# EAGLE design Handheld (EAGLE 8.0.0)
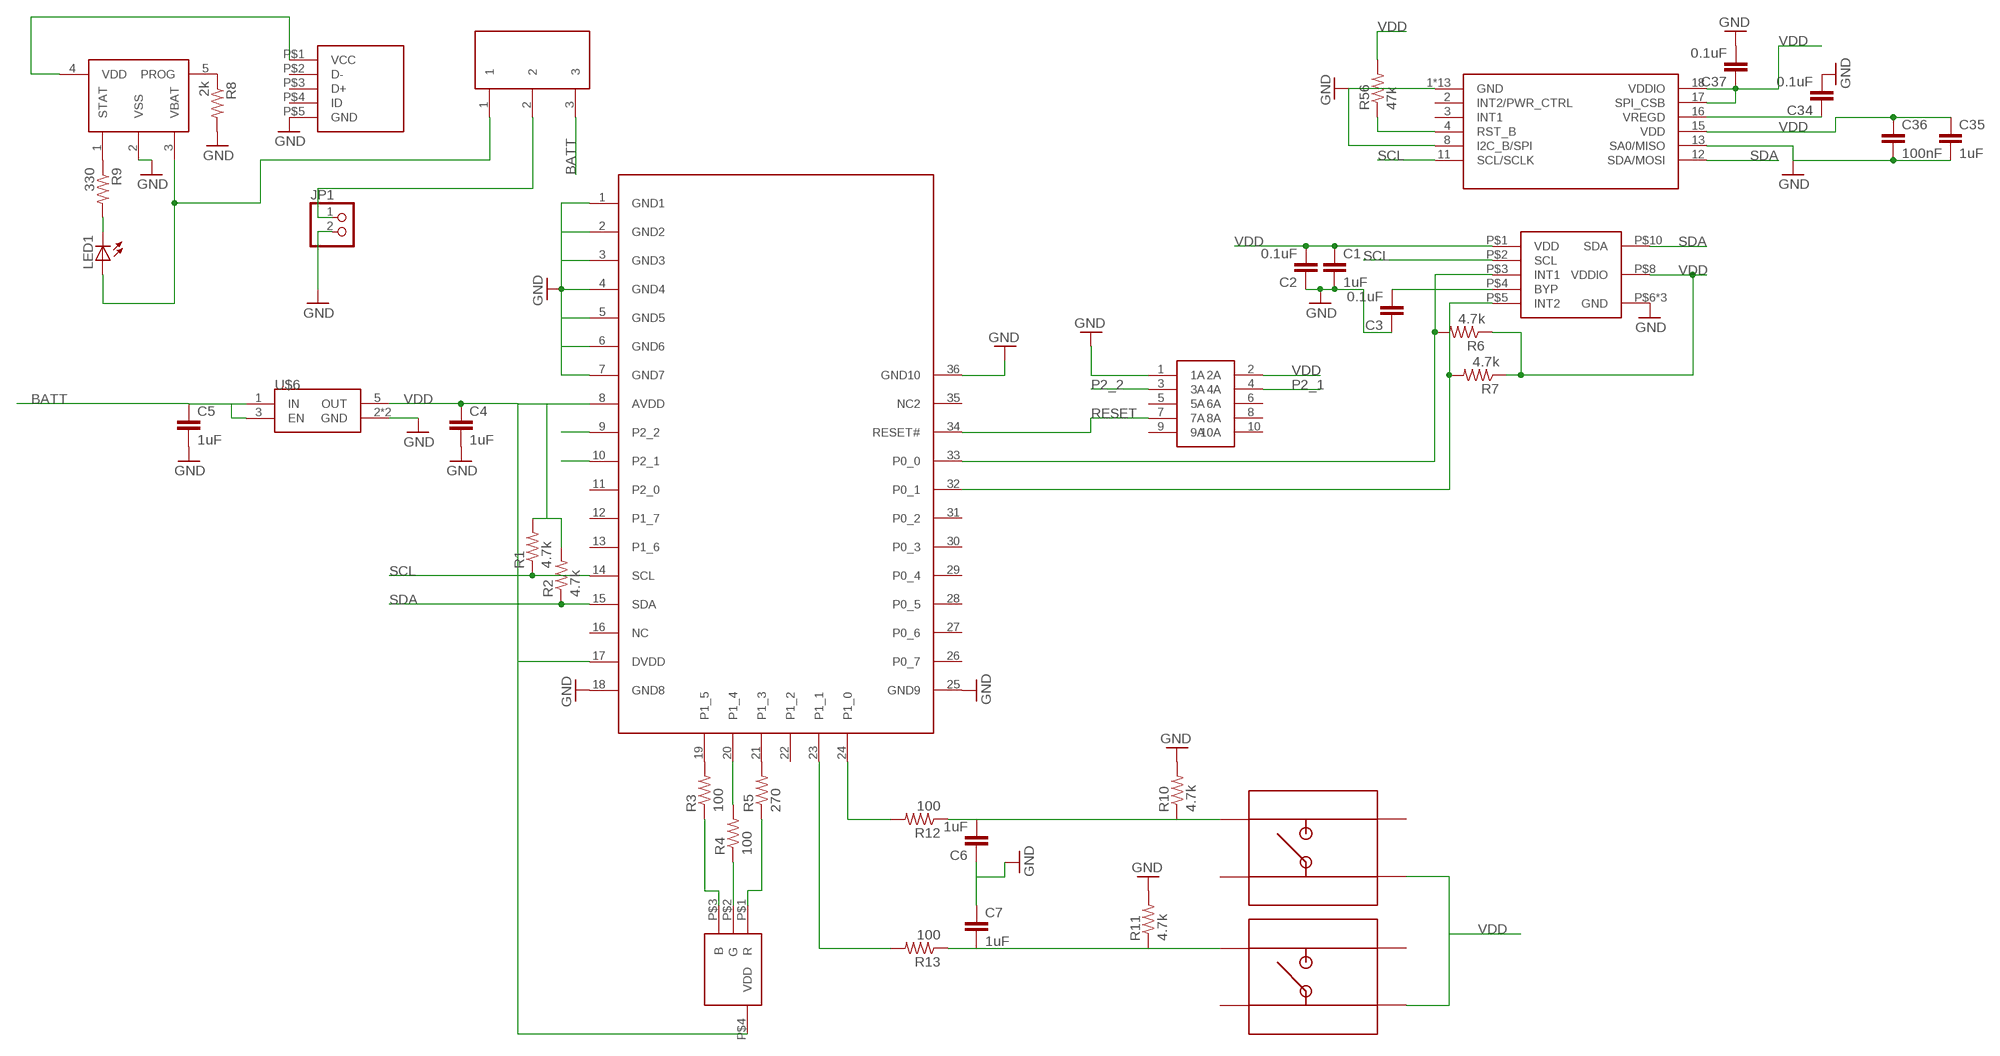
[diagram p0: schematic, sheet 1]

## Parts
C1  1uF  C-EUC0402  [C0402]
C2  0.1uF  C-EUC0402  [C0402]
C3  0.1uF  C-EUC0402  [C0402]
C4  1uF  C-EUC0402  [C0402]
C5  1uF  C-EUC0402  [C0402]
C6  1uF  C-EUC0402  [C0402]
C7  1uF  C-EUC0402  [C0402]
C34  0.1uF  C-EUC0402  [C0402]
C35  1uF  C-EUC0402  [C0402]
C36  100nF  C-EUC0402  [C0402]
C37  0.1uF  C-EUC0402  [C0402]
JP1  PINHD-1X2  [1X02]
LED1  LEDCHIPLED_0805  [CHIPLED_0805]
R1  4.7k  R-US_R0402  [R0402]
R2  4.7k  R-US_R0402  [R0402]
R3  100  R-US_R0402  [R0402]
R4  100  R-US_R0402  [R0402]
R5  270  R-US_R0402  [R0402]
R6  4.7k  R-US_R0402  [R0402]
R7  4.7k  R-US_R0402  [R0402]
R8  2k  R-US_R0402  [R0402]
R9  330  R-US_R0402  [R0402]
R10  4.7k  R-US_R0402  [R0402]
R11  4.7k  R-US_R0402  [R0402]
R12  100  R-US_R0402  [R0402]
R13  100  R-US_R0402  [R0402]
R56  47k  R-US_R0402  [R0402]
U$1  BLE113  [BLUEGIGA]
U$2  RIBBON_10POS_MALE  [RIBBON_10POS_MALE]
U$3  MMA8653FC  [10-DFN2X2]
U$4  MCP73831  [MCP73831]
U$5  MICRO_USB  [MOLEX_USB]
U$6  TPS782XX  [SOT23-5L]
U$7  LTST-C19HE1WT  [LTST-C19HE1WT]
U$8  SMD_TACTILE  [EVQ-Q2U03W]
U$9  SMD_TACTILE  [EVQ-Q2U03W]
U$10  SPDT_THRU  [SPDT_THRU]
U$34  FXAS21002  [FXAS21002]

## Nets
BATT: C5.1 U$6.1(IN) U$6.3(EN) U$10.3
GND: C1.2 C2.1 C3.1 C4.2 C5.2 C6.1 C7.1 C34.2 C35.2 C36.2 C37.2 JP1.2 R8.2 R10.2 R11.2 U$1.1(GND1) U$1.2(GND2) U$1.3(GND3) U$1.4(GND4) U$1.5(GND5) U$1.6(GND6) U$1.7(GND7) U$1.18(GND8) U$1.25(GND9) U$1.36(GND10) U$2.1(1A) U$3.P$6(GND) U$3.P$7(GND) U$3.P$9(GND) U$4.2(VSS) U$5.P$5(GND) U$6.2(GND) U$6.4(GND) U$34.1(GND) U$34.5(GND) U$34.6(GND) U$34.7(GND) U$34.8(I2C_B/SPI) U$34.9(GND) U$34.10(GND) U$34.13(SA0/MISO) U$34.14(GND) U$34.19(GND) U$34.20(GND) U$34.21(GND) U$34.22(GND) U$34.23(GND) U$34.24(GND)
N$1: C7.2 R11.1 R13.1 U$9.1
N$2: R3.2 U$1.19(P1_5)
N$3: C3.2 U$3.P$4(BYP)
N$4: R4.2 U$1.20(P1_4)
N$5: R5.2 U$1.21(P1_3)
N$6: R3.1 U$7.P$3(B)
N$7: R4.1 U$7.P$2(G)
N$8: R5.1 U$7.P$1(R)
N$9: R6.2 U$1.33(P0_0) U$3.P$3(INT1)
N$10: R7.2 U$1.32(P0_1) U$3.P$5(INT2)
N$11: R8.1 U$4.5(PROG)
N$12: R9.1 U$4.1(STAT)
N$13: LED1.C R9.2
N$14: LED1.A U$4.3(VBAT) U$10.1
N$15: U$4.4(VDD) U$5.P$1(VCC)
N$16: JP1.1 U$10.2
N$17: R13.2 U$1.23(P1_1)
N$18: U$1.9(P2_2)
N$19: U$1.10(P2_1)
N$20: R12.2 U$1.24(P1_0)
N$22: C6.2 R10.1 R12.1 U$8.1
N$30: R56.1 U$34.4(RST_B)
N$78: C34.1 U$34.16(VREGD)
P2_1: U$2.4(4A)
P2_2: U$2.3(3A)
RESET: U$1.34(RESET#) U$2.7(7A)
SCL: R1.1 U$1.14(SCL) U$3.P$2(SCL) U$34.11(SCL/SCLK)
SDA: R2.1 U$1.15(SDA) U$3.P$10(SDA) U$34.12(SDA/MOSI)
VDD: C1.1 C2.2 C4.1 C35.1 C36.1 C37.1 R1.2 R2.2 R6.1 R7.1 R56.2 U$1.8(AVDD) U$1.17(DVDD) U$2.2(2A) U$3.P$1(VDD) U$3.P$8(VDDIO) U$6.5(OUT) U$7.P$4(VDD) U$8.4 U$9.4 U$34.15(VDD) U$34.17(SPI_CSB) U$34.18(VDDIO)
Unconnected: U$1.11(P2_0) U$1.12(P1_7) U$1.13(P1_6) U$1.16(NC) U$1.22(P1_2) U$1.26(P0_7) U$1.27(P0_6) U$1.28(P0_5) U$1.29(P0_4) U$1.30(P0_3) U$1.31(P0_2) U$1.35(NC2) U$2.5(5A) U$2.6(6A) U$2.8(8A) U$2.9(9A) U$2.10(10A) U$5.P$2(D-) U$5.P$3(D+) U$5.P$4(ID) U$8.2 U$8.3 U$9.2 U$9.3 U$34.2(INT2/PWR_CTRL) U$34.3(INT1)

## Library data of the parts
C1-C7 C34-C37 = rcl:C-EU: CAPACITOR, European symbol
JP1 = pinhead:PINHD-1X2: PIN HEADER
LED1 = adafruit:LED: LED OSRAM: - CHIPLED LG R971, LG N971, LY N971, LG Q971, LY Q971, LO R971, LY R971 LH N974, LH R974 LS Q976, LO Q976, LY Q976 LO Q996 - Hyper CHIPLED LW Q18S LB Q993, LB Q99A, LB R99A - SideLED LS A670, LO A670, LY A670, LG A670, LP A670 LB A673, LV A673, LT A673, LW A673 LH A674 LY A675 LS A676, LA A676, LO A676, LY A676, LW A676 LS A679, LY A679, LG A679 - Hyper Micro SIDELED® LS Y876, LA Y876, LO Y876, LY Y876 LT Y87S - SmartLED LW L88C, LW L88S LB L89C, LB L89S, LG L890 LS L89K, LO L89K, LY L89K LS L896, LA L896, LO L896, LY L896 - TOPLED LS T670, LO T670, LY T670, LG T670, LP T670 LSG T670, LSP T670, LSY T670, LOP T670, LYG T670 LG T671, LOG T671, LSG T671 LB T673, LV T673, LT T673, LW T673 LH T674 LS T676, LA T676, LO T676, LY T676, LB T676, LH T676, LSB T676, LW T676 LB T67C, LV T67C, LT T67C, LS T67K, LO T67K, LY T67K, LW E67C LS E67B, LA E67B, LO E67B, LY E67B, LB E67C, LV E67C, LT E67C LW T67C LS T679, LY T679, LG T679 LS T770, LO T770, LY T770, LG T770, LP T770 LB T773, LV T773, LT T773, LW T773 LH T774 LS E675, LA E675, LY E675, LS T675 LS T776, LA T776, LO T776, LY T776, LB T776 LHGB T686 LT T68C, LB T68C - Hyper Mini TOPLED® LB M676 - Mini TOPLED Santana® LG M470 LS M47K, LO M47K, LY M47K Source: http://www.osram.convergy.de/
R1-R13 R56 = rcl:R-US_: RESISTOR, American symbol
U$1 = James_Updated:BLE113
U$2 = James_Updated[Conflict]:RIBBON_10POS_MALE
U$3 = Charles:MMA8653FC: 3-Axis, 10-bit Digital Accelerometer
U$4 = Charles:MCP73831: Miniature Single-Cell, Fully Integrated Li-Ion/Li-Poly Charge Management Controller
U$5 = James_Updated:MICRO_USB: Molex Micro USB AB RA SMD Bottom Mount
U$6 = James_Updated:TPS782XX: TPS782 500-nA IQ,150-mA, Ultra-Low Quiescent Current Low-Dropout Linear Regulator
U$7 = Charles:LTST-C19HE1WT
U$8 U$9 = Charles:SMD_TACTILE: Panasonic Switch Tactile SPST-NO 0.02A 15V
U$10 = James_Updated[Conflict]:SPDT_THRU
U$34 = Charles:FXAS21002: 3-Axis Digital Angular Rate Gyroscope (I2C/SPI)

## Board
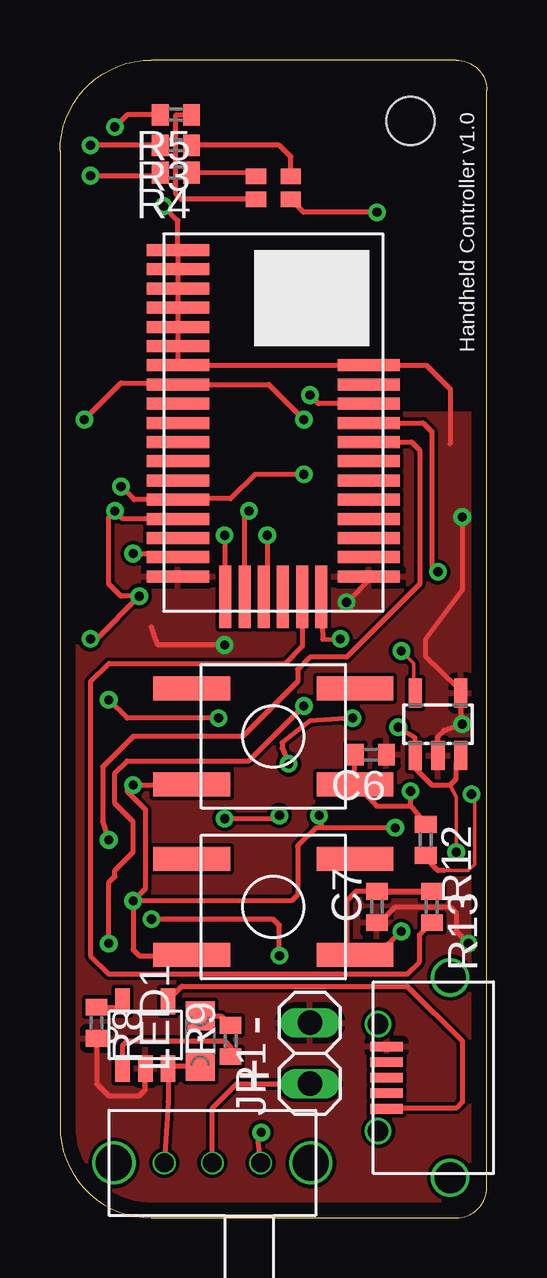
[diagram p1: board, top side]
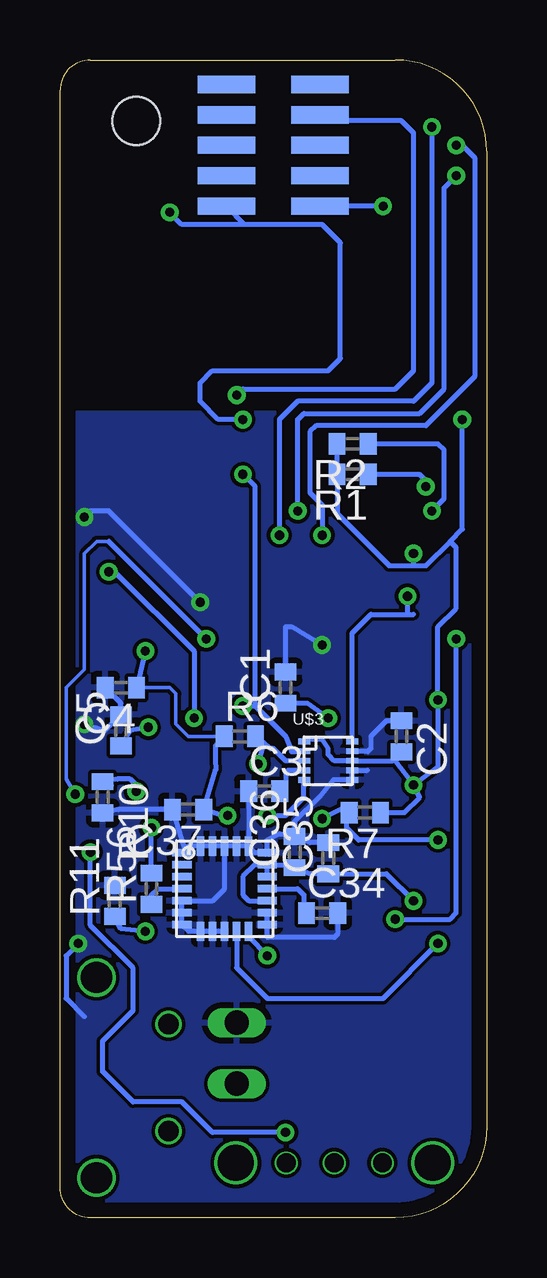
[diagram p2: board, bottom side, seen from below]

Size 17.78 x 48.26 mm. Coordinates in mm from the lower left corner, seen from the top.
Outline: 3.81,0 16.51,0 arc90 17.78,1.27 17.78,46.99 arc90 16.51,48.26 3.81,48.26 arc90 0,44.45 0,3.81 arc90 3.81,0
Copper layers (1*16): Top 0.035mm / dielectric 1.5mm / Bottom 0.035mm
Design rules "DRC_rules *": minimum track width 8mil, minimum drill 15mil, track to track 6mil, track to pad 6mil, pad to pad 6mil, via to via 6mil, smd to smd 6mil, copper to edge 25mil, drill to drill 6mil, minimum pad ring 2mil, minimum via ring 2mil, stop-mask expansion 4mil, vias tented up to drill 0mil, thermal gap 10mil
Holes 2 mm at 14.61,45.72

### Footprints (pad centres in the part's own frame; a part is rotated, then mirrored left to right if it is on the bottom)
C0402 = smd 0.7 x 0.9: 1 -0.65,0; 2 0.65,0
1X02 = drill 1.016 long: 1 -1.27,0; 2 1.27,0
CHIPLED_0805 = smd 1.2 x 1.2: A 0,-1.05; C 0,1.05
R0402 = smd 0.7 x 0.9: 1 -0.65,0; 2 0.65,0
BLUEGIGA = smd 2.6 x 0.5: 1 -3.975,9.6; 2 -3.975,8.8; 3 -3.975,8; 4 -3.975,7.2; 5 -3.975,6.4; 6 -3.975,5.6; 7 -3.975,4.8; 8 -3.975,4; 9 -3.975,3.2; 10 -3.975,2.4; 11 -3.975,1.6; 12 -3.975,0.8; 13 -3.975,0; 14 -3.975,-0.8; 15 -3.975,-1.6; 16 -3.975,-2.4; 17 -3.975,-3.2; 18 -3.975,-4; 25 3.975,-4; 26 3.975,-3.2; 27 3.975,-2.4; 28 3.975,-1.6; 29 3.975,-0.8; 30 3.975,0; 31 3.975,0.8; 32 3.975,1.6; 33 3.975,2.4; 34 3.975,3.2; 35 3.975,4; 36 3.975,4.8 | smd 0.5 x 2.6: 19 -2,-4.85; 20 -1.2,-4.85; 21 -0.4,-4.85; 22 0.4,-4.85; 23 1.2,-4.85; 24 2,-4.85
RIBBON_10POS_MALE = smd 0.72 x 2.4: 1 -5.08,-1.95; 2 -5.08,1.95; 3 -3.81,-1.95; 4 -3.81,1.95; 5 -2.54,-1.95; 6 -2.54,1.95; 7 -1.27,-1.95; 8 -1.27,1.95; 9 0,-1.95; 10 0,1.95
10-DFN2X2 = smd 0.5 x 0.24: P$1 -1,0.8; P$2 -1,0.4; P$3 -1,0; P$4 -1,-0.4; P$5 -1,-0.8; P$6 1,-0.8; P$7 1,-0.4; P$8 1,0; P$9 1,0.4; P$10 1,0.8
MCP73831 = smd 0.6 x 1.1: 1 -0.95,-1.4; 2 0,-1.4; 3 0.95,-1.4; 4 0.95,1.4; 5 -0.95,1.4
MOLEX_USB = smd 0.4 x 1.35: P$1 -1.3,2.65; P$2 -0.65,2.65; P$3 0,2.65; P$4 0.65,2.65; P$5 1.3,2.65 | drill 0.85 pad 1.1: P$6 -2.225,3; P$7 2.225,3 | drill 1.3 pad 1.6: P$8 -4.175,0; P$9 4.175,0
SOT23-5L = smd 0.55 x 1.2: 1 -0.95,-1.3; 2 0,-1.3; 3 0.95,-1.3; 4 0.95,1.3; 5 -0.95,1.3
LTST-C19HE1WT = smd 0.65 x 0.85: P$1 -0.475,0.725; P$2 0.475,0.725; P$3 0.475,-0.725; P$4 -0.475,-0.725
EVQ-Q2U03W = smd 3.2 x 1: 1 -3.4,2; 2 -3.4,-2; 3 3.4,-2; 4 3.4,2
SPDT_THRU = drill 0.787: 1 -2.007,0; 2 0,0; 3 2.007,0 | drill 1.499: A1 -4.102,0; A2 4.102,0
FXAS21002 = smd 0.8 x 0.3: 1 -1.775,1.5; 2 -1.775,1; 3 -1.775,0.5; 4 -1.775,0; 5 -1.775,-0.5; 6 -1.775,-1; 7 -1.775,-1.5; 13 1.775,-1.5; 14 1.775,-1; 15 1.775,-0.5; 16 1.775,0; 17 1.775,0.5; 18 1.775,1; 19 1.775,1.5 | smd 0.3 x 0.8: 8 -1,-1.775; 9 -0.5,-1.775; 10 0,-1.775; 11 0.5,-1.775; 12 1,-1.775; 20 1,1.775; 21 0.5,1.775; 22 0,1.775; 23 -0.5,1.775; 24 -1,1.775

### Placement (x,y rotation side)
C1  8.38,22.1 90 bottom
C2  3.56,20.07 270 bottom
C3  9.27,17.78 0 bottom
C4  15.24,22.1 180 bottom
C5  15.24,20.32 90 bottom
C6  12.95,19.3 180 top
C7  13.21,12.95 90 top
C34  6.86,12.7 0 bottom
C35  6.6,14.99 90 bottom
C36  8,15.24 90 bottom
C37  12.45,17.02 180 bottom
JP1  10.41,6.86 90 top
LED1  5.84,7.37 0 top
R1  5.59,30.99 180 bottom
R2  5.59,32.26 180 bottom
R3  4.83,44.7 180 top
R4  4.83,43.56 180 top
R5  4.83,45.97 180 top
R6  10.29,20.07 0 bottom
R7  5.08,16.89 180 bottom
R8  1.52,8.13 270 top
R9  7.11,7.37 90 top
R10  16,17.53 270 bottom
R11  15.49,13.21 90 bottom
R12  15.24,15.75 270 top
R13  15.49,12.95 270 top
R56  13.97,13.72 90 bottom
U$1  8.89,30.73 0 top
U$2  8.89,47.24 90 bottom
U$3  6.6,19.05 0 bottom
U$4  3.56,7.62 0 top
U$5  16.26,5.84 90 top
U$6  15.75,20.57 0 top
U$7  8.89,42.93 90 top
U$8  8.89,20.07 180 top
U$9  8.89,12.95 180 top
U$10  6.35,2.29 0 top
U$34  10.92,13.72 0 bottom

### Tracks (layer width: path | path; a pad name or v marks a point on that pad's centre or on a via)
BATT  (via drill 0.38 pad 0.74)
  Top 0.152: v16.51,15.24 16.51,17.53 16.26,18.03
  Top 0.203: U$6.3 16.51,18.95 16.51,18.29 16.26,18.03 15.49,18.03 14.8,18.73 U$6.1 14.8,20 v14.1,20.45 | U$10.3 8.27,3.16 v8.38,3.56
  Bottom 0.203: v14.1,20.45 14.84,20.32 C5.1 | v8.38,3.56 11.43,3.56 12.7,4.83 14.73,4.83 16,6.1 16,7.37 14.73,8.64 14.73,10.41 16.51,12.19 v16.51,15.24
GND  (via drill 0.38 pad 0.74)
  Top 0.203: R8.2 1.52,5.59 2.03,5.08 3.3,5.08 3.56,5.33 U$4.2 | U$1.7 U$1.36 | U$1.7 U$1.6 U$1.5 U$1.4 U$1.3 U$1.2 U$1.1 4.92,41.57 v4.32,42.16 | U$1.25 12.93,26.67 12.93,26.64 v11.94,25.65 | U$1.7 15.27,35.53 16.26,34.54 16.26,32.26 | v16.76,29.21 16.76,26.16 15.24,24.13 15.24,23.37 16.54,22.13 U$6.4 16.7,20.64 v16.76,20.57 16,20.32 15.75,20.07 U$6.2 | v6.86,23.88 4.06,23.88 3.81,24.64 | C7.1 13.32,12.3 13.97,12.95 16.26,12.95 16.51,12.7 16.51,11.94 v17.02,11.43
  Bottom 0.203: U$34.22 U$34.21 U$34.20 | U$34.10 U$34.9 U$34.8 11.94,11.94 12.42,11.94 U$34.7 U$34.6 U$34.5 11.42,13.22 10.92,13.72 U$34.22 | U$34.22 U$34.23 U$34.24 12.42,15.49 U$34.1 12.59,15.32 C37.2 15.35,17.02 R10.2 | v4.32,42.16 U$2.1 | C4.2 15.24,21.45 C5.2 15.89,20.32 v16.76,20.57 | U$34.20 9.65,15.22 U$34.19 9.15,15.74 8.64,16 7.99,16 C36.2 | C34.2 6.21,11.83 6.35,11.68 9.14,11.68 U$34.13 U$34.14 | C35.2 7.37,15.64 C36.2 | C3.1 9.92,15.62 U$34.20 | C36.2 8,16.52 6.99,17.53 6.39,18.25 U$3.P$6 U$3.P$7 4.97,18.65 | v16.76,29.21 16.51,29.46 15.75,29.46 v11.94,25.65 | C1.2 8.38,24.64 8.13,24.64 v6.86,23.88 | C2.1 4.18,20.72 4.83,20.07 4.83,19.56 4.95,19.43 5.58,19.43 U$3.P$9 | v17.02,11.43 17.53,10.92 17.53,9.14 16.76,8.38
  pour Bottom: 0,33.53 17.78,33.53 17.78,0 0,0
  pour Top: 0,33.53 17.78,33.53 17.78,0 0,0
N$1  (via drill 0.38 pad 0.74)
  Top 0.203: 13.18,10.95 v14.22,11.94 | C7.2 12.33,13.6 11.94,13.21 11.94,11.31 U$9.1
  Top 0.254: C7.2 R13.1
  Top 0.406: U$9.1 13.18,10.95
  Bottom 0.203: v14.22,11.94 15.24,12.05 R11.1
N$2  (via drill 0.38 pad 0.74)
  Top 0.203: R3.2 v1.27,44.7 | v6.86,28.45 6.86,25.92 U$1.19
  Bottom 0.203: v1.27,44.7 1.02,44.7 0.51,44.2 0.51,35.05 2.54,33.02 7.11,33.02 7.37,32.77 7.37,30.23 6.86,29.72 v6.86,28.45
N$3
  Bottom 0.203: U$3.P$4 8.27,18.65 8.38,18.54 8.38,17.89 C3.2
N$4  (via drill 0.38 pad 0.74)
  Top 0.203: U$1.20 7.69,29.28 v7.87,29.46 | v1.27,43.43 4.05,43.43 R4.2
  Bottom 0.203: v7.87,29.46 7.87,33.27 7.62,33.53 2.79,33.53 1.78,34.54 1.78,42.93 v1.27,43.43
N$5  (via drill 0.38 pad 0.74)
  Top 0.203: R5.2 2.79,45.97 v2.29,45.47 | v8.64,28.45 8.64,26.03 U$1.21
  Bottom 0.203: v2.29,45.47 2.29,34.8 3.05,34.04 7.87,34.04 8.64,33.27 v8.64,28.45
N$6
  Top 0.203: U$7.P$3 9.62,44.23 9.14,44.7 R3.1
N$7
  Top 0.203: R4.1 7.99,43.58 U$7.P$2
N$8
  Top 0.203: U$7.P$1 5.05,42.45 4.83,42.67 4.83,45.97 R5.1
N$9  (via drill 0.38 pad 0.74)
  Top 0.203: U$1.33 15.13,33.13 15.49,32.77 15.49,27.18 v15.75,26.92 | v12.19,20.83 10.4,20.7 9.26,19.81 9.26,19.57 v9.53,18.92
  Bottom 0.203: v15.75,26.92 15.49,26.92 12.19,23.62 v12.19,20.83 | U$3.P$3 8.38,19.05 8.89,19.56 9,19.56 R6.2 9.27,19.8 v9.53,18.92
N$10  (via drill 0.38 pad 0.74)
  Top 0.203: U$1.32 14.66,32.33 14.99,32 14.99,26.42 11.94,23.37 10.41,23.37 9.91,22.86 9.91,22.35 7.62,20.07 3.05,20.07 1.78,18.8 1.78,16.51 v2.03,15.75 | v6.86,16.64 9.02,16.64 v9.14,16.76
  Bottom 0.203: v2.03,15.75 5.33,15.75 5.84,16.26 5.84,16.78 R7.2 5.86,17.02 6.1,17.02 v6.86,16.64 | v9.14,16.76 8.38,16.76 7.62,17.53 7.62,17.98 U$3.P$5
N$11
  Top 0.203: R8.1 2.36,8.78 U$4.5
N$12
  Top 0.203: U$4.1 2.61,7.18 2.79,7.37 6.86,7.37 7.11,7.11 R9.1
N$13
  Top 0.203: LED1.C 6.71,8.42 R9.2
N$14
  Top 0.203: LED1.A 4.6,6.32 U$4.3 4.51,4.84 U$10.1
N$15
  Top 0.203: U$4.4 4.51,9.08 5.08,9.65 14.48,9.65 16.76,7.37 16.76,4.83 16.51,4.57 13.61,4.57 U$5.P$1
N$16
  Top 0.203: U$10.2 6.35,4.57 7.37,5.59 JP1.1
N$17
  Top 0.203: U$1.23 10.09,23.81 9.4,23.11 2.03,23.11 1.27,22.35 1.27,10.92 2.03,10.16 14.48,10.16 14.99,10.67 14.99,11.8 R13.2
N$20  (via drill 0.38 pad 0.74)
  Top 0.152: 16,14.48 17.02,14.48 17.27,14.73 17.27,17.53 v17.14,17.65
  Top 0.203: U$1.24 10.95,24.11 v11.68,24.13 | 16,14.48 15.75,14.48 15.49,14.73 R12.2
  Bottom 0.152: 15.75,28.19 16.26,28.19 16.76,27.69 16.76,22.86 17.53,22.1 17.53,18.29 v17.14,17.65
  Bottom 0.203: v11.68,24.13 15.75,28.19
N$22  (via drill 0.38 pad 0.74)
  Top 0.203: C6.2 12.19,17.97 U$8.1 13.2,17.16 14.61,17.16 | 14.61,17.16 R12.1 | 14.61,17.16 v14.61,17.78
  Bottom 0.203: 15.64,18.03 R10.1 15.38,18.29 14.86,18.29 14.61,18.03 v14.61,17.78
N$30
  Bottom 0.203: R56.1 13.97,13.46 13.72,13.72 U$34.4
N$78
  Bottom 0.203: U$34.16 7.87,13.72 7.62,13.46 7.62,12.81 C34.1
RESET  (via drill 0.38 pad 0.74)
  Top 0.203: U$1.34 10.77,33.93 v10.41,34.29
  Bottom 0.203: v10.41,34.29 10.16,34.54 3.81,34.54 3.05,35.31 3.05,45.21 3.56,45.72 6.69,45.72 U$2.7
SCL  (via drill 0.38 pad 0.74)
  Top 0.203: v2.54,30.48 3.09,29.93 U$1.14 4.95,29.97 7.11,29.97 8.13,30.99 v10.16,30.99 | v2.03,11.43 2.03,13.97 2.29,14.22 2.29,14.48 3.05,15.24 3.05,16.51 2.29,17.27 2.29,18.54 2.79,19.05 7.87,19.05 v10.16,21.34
  Bottom 0.203: v2.54,30.48 2.54,30.73 2.79,30.99 R1.1 | U$34.11 10.42,10.42 9.14,9.14 4.32,9.14 v2.03,11.43 | v10.16,21.34 9.65,21.34 | 9.65,21.34 8.38,20.07 8.13,19.43 7.62,19.43 U$3.P$2 | 9.65,21.34 9.65,30.48 v10.16,30.99
SDA  (via drill 0.38 pad 0.74)
  Top 0.203: U$1.15 2.62,29.13 v2.29,29.46 2.03,29.21 2.03,26.42 2.54,25.91 v3.3,25.91 1.52,24.13 v1.27,24.13 | v9.14,10.92 9.14,12.19 8.89,12.45 v3.81,12.45
  Bottom 0.203: v2.29,29.46 1.78,29.97 1.78,32 2.03,32.26 R2.1 | U$3.P$10 5.6,24.37 4.83,25.15 3.3,25.15 | 3.3,25.15 3.05,25.15 | U$34.12 9.92,11.7 v9.14,10.92 | v3.81,12.45 1.52,12.45 1.27,12.7 v1.27,24.13 | v3.3,25.91 3.3,25.15
VDD  (via drill 0.38 pad 0.74)
  Top 0.152: v14.22,23.62 14.73,23.11 14.73,21.81 U$6.5
  Top 0.203: U$8.4 5.46,18.03 v3.05,18.03 2.79,17.78 3.56,17.02 3.56,13.72 v3.05,13.21 | v10.16,33.27 8.7,34.73 U$1.8 4.85,34.8 2.54,34.8 v1.02,33.27 | v13.21,41.91 10.16,41.91 U$7.P$4 | v13.97,16.26 10.92,16.26 | 10.92,16.26 v10.79,16.76 | v3.05,13.21 3.05,11.18 3.3,10.92 5.46,10.92 U$9.4 | 10.92,16.26 10.67,16.26 9.91,15.49 9.91,13.46 9.65,13.21 v3.05,13.21 | v6.6,20.83 2.79,20.83 v2.03,21.59 | v3.05,27.69 4.92,27.69 U$1.17
  Bottom 0.152: R6.1 12.45,20.07 12.95,20.57 12.95,21.84 13.21,22.1 C4.1
  Bottom 0.203: U$34.18 8,14.72 C36.1 7.37,14.34 C35.1 4.18,14.34 v3.05,13.21 | U$34.17 U$34.18 | R2.2 R1.2 6.24,29.35 4.06,27.18 3.05,27.18 | v14.22,23.62 C4.1 | U$3.P$1 7.57,19.94 6.86,19.94 6.6,19.56 6.6,19.3 6.35,19.05 U$3.P$8 3.92,19.05 | R7.1 3.43,16.89 2.79,17.53 v3.05,18.03 | 3.92,19.05 C2.2 | v10.16,33.27 11.18,33.27 11.94,34.04 11.94,34.8 11.43,35.31 6.6,35.31 6.1,35.81 6.1,40.64 6.86,41.4 10.08,41.4 | 10.08,41.4 U$2.2 | 10.08,41.4 12.7,41.4 v13.21,41.91 | 3.05,27.18 2.54,27.18 1.52,28.19 | 1.52,28.19 1.02,28.7 v1.02,33.27 | R6.1 10.79,19.81 11.3,19.68 11.3,19.08 11.29,18.68 C37.1 11.03,16.76 v10.79,16.76 | R56.2 v13.97,16.26 | v3.05,18.03 3.81,19.05 3.92,19.05 | U$34.18 9.67,14.72 10.16,14.22 10.16,13.46 9.91,13.21 9.15,13.21 U$34.15 | C1.1 7.48,21.45 v6.6,20.83 | v3.05,18.03 2.03,18.8 v2.03,21.59 2.03,24.64 1.27,25.4 1.27,27.94 1.52,28.19 | 3.05,27.18 v3.05,27.69

### Text on the board
tPlace: Handheld Controller v1.0 | - | +